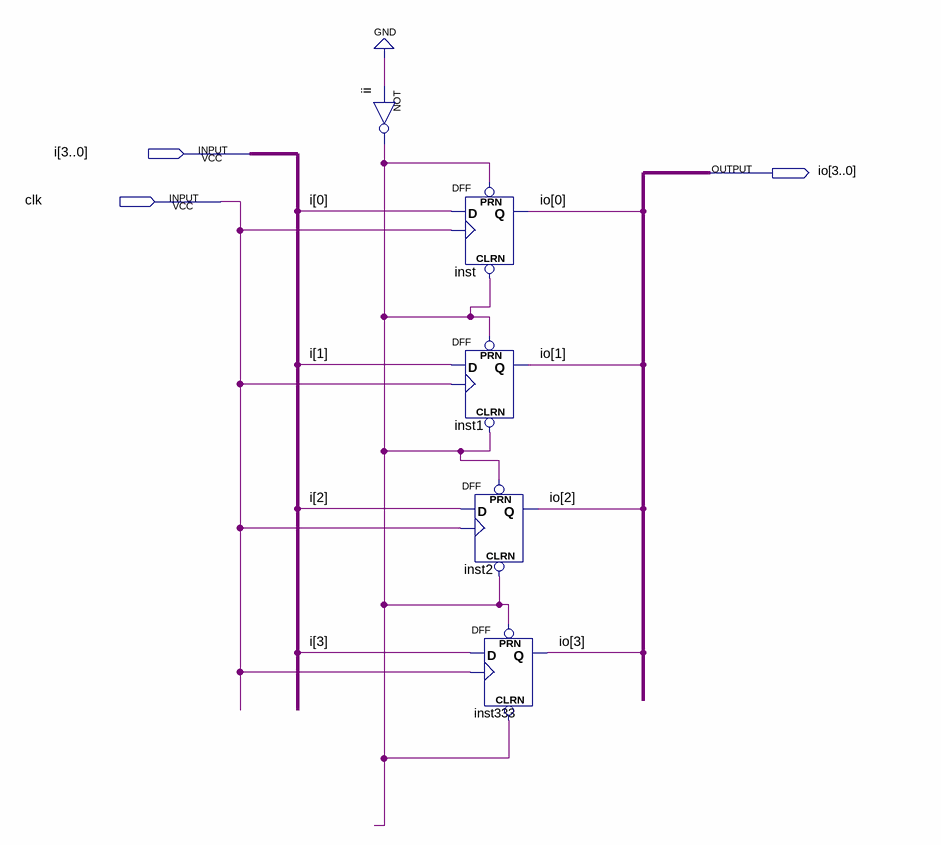
[diagram p0: schematic sheet]
// Quartus schematic Rigister.bdf as structural Verilog: 5 symbols, 3 pins
module Rigister (
  input  [3:0] i,
  input  clk,
  output [3:0] io
);

  wire ii_out;

  not ii (ii_out, 1'b0);
  DFF inst (.CLRN(ii_out), .CLK(clk), .D(i[0]), .PRN(ii_out), .Q(io[0]));
  DFF inst1 (.CLRN(ii_out), .CLK(clk), .D(i[1]), .PRN(ii_out), .Q(io[1]));
  DFF inst2 (.CLRN(ii_out), .CLK(clk), .D(i[2]), .PRN(ii_out), .Q(io[2]));
  DFF inst333 (.CLRN(ii_out), .CLK(clk), .D(i[3]), .PRN(ii_out), .Q(io[3]));
endmodule
